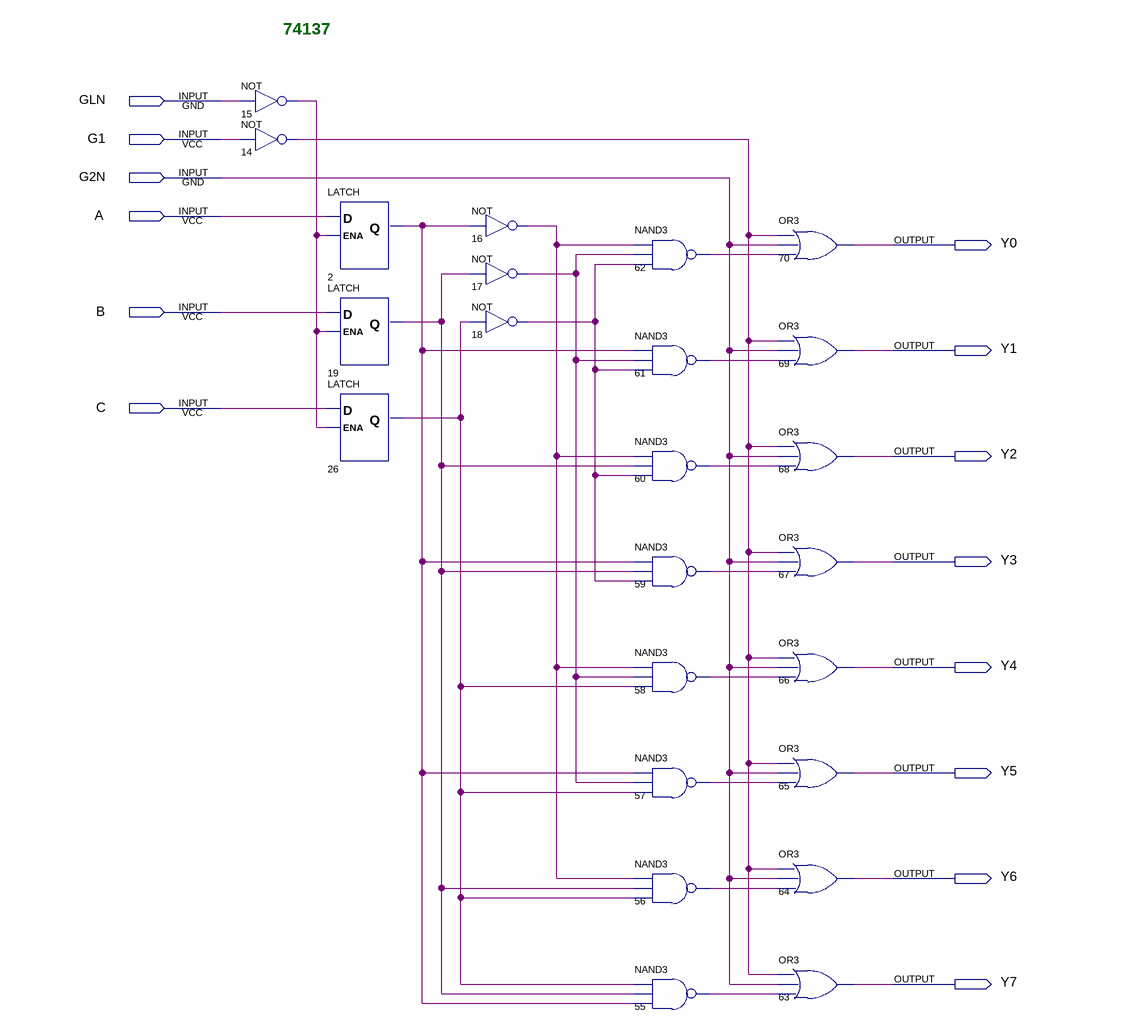
[diagram p0: schematic sheet]
// Quartus schematic 74137.bdf as structural Verilog: 24 symbols, 14 pins
module \74137  (
  input  GLN,
  input  G1,
  input  G2N,
  input  A,
  input  B,
  input  C,
  output Y0,
  output Y1,
  output Y2,
  output Y3,
  output Y4,
  output Y5,
  output Y6,
  output Y7
);

  wire n2_q, n14_out, n15_out, n16_out, n17_out, n18_out, n19_q, n26_q, n55_out, n56_out, n57_out, n58_out,
       n59_out, n60_out, n61_out, n62_out;

  not u_15 (n15_out, GLN);
  not u_14 (n14_out, G1);
  LATCH u_2 (.D(A), .ENA(n15_out), .Q(n2_q));
  LATCH u_19 (.D(B), .ENA(n15_out), .Q(n19_q));
  LATCH u_26 (.D(C), .ENA(n15_out), .Q(n26_q));
  not u_16 (n16_out, n2_q);
  not u_17 (n17_out, n19_q);
  not u_18 (n18_out, n26_q);
  nand u_62 (n62_out, n16_out, n17_out, n18_out);
  nand u_61 (n61_out, n2_q, n17_out, n18_out);
  nand u_60 (n60_out, n16_out, n19_q, n18_out);
  nand u_59 (n59_out, n2_q, n19_q, n18_out);
  nand u_58 (n58_out, n16_out, n17_out, n26_q);
  nand u_57 (n57_out, n2_q, n17_out, n26_q);
  nand u_56 (n56_out, n16_out, n19_q, n26_q);
  nand u_55 (n55_out, n26_q, n19_q, n2_q);
  or u_70 (Y0, n14_out, G2N, n62_out);
  or u_69 (Y1, n14_out, G2N, n61_out);
  or u_68 (Y2, n14_out, G2N, n60_out);
  or u_67 (Y3, n14_out, G2N, n59_out);
  or u_66 (Y4, n14_out, G2N, n58_out);
  or u_65 (Y5, n14_out, G2N, n57_out);
  or u_64 (Y6, n14_out, G2N, n56_out);
  or u_63 (Y7, n14_out, G2N, n55_out);

  // Notes on the sheet:
  //   74137
endmodule
